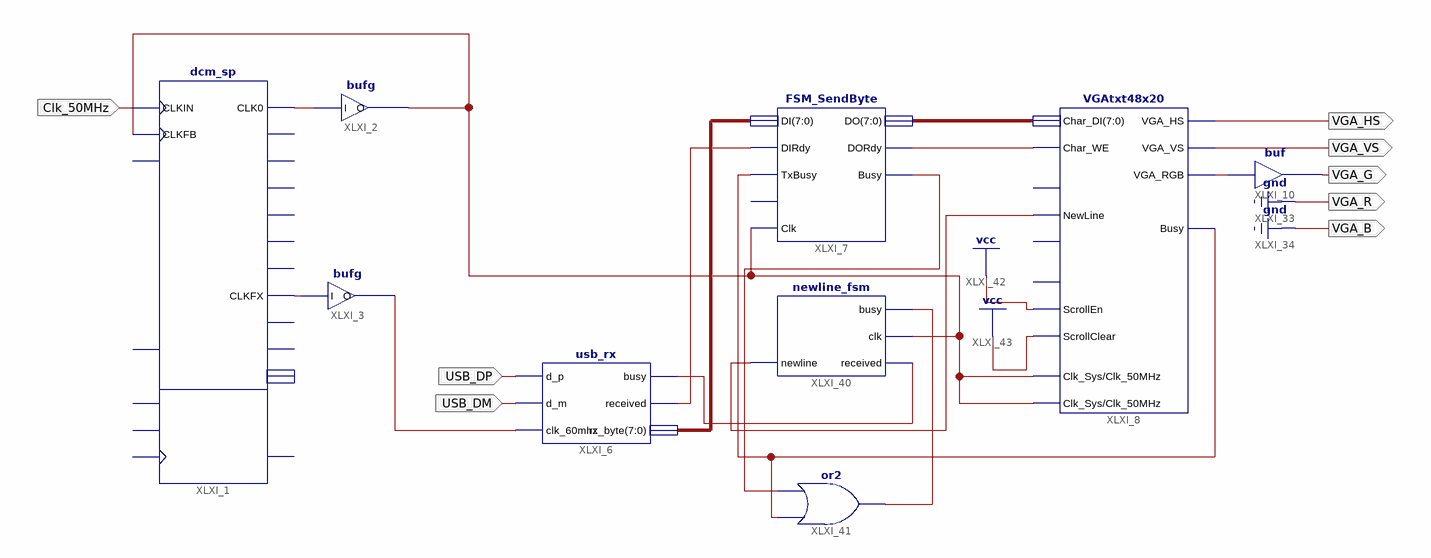
[diagram p0: schematic sheet 1]
// Xilinx ISE schematic top_lvl.sch (spartan3e) as structural Verilog: 9 symbols, 8 ports
module top_lvl (
  input  Clk_50MHz,
  input  USB_DM,
  input  USB_DP,
  output VGA_HS,
  output VGA_VS,
  output VGA_R,
  output VGA_G,
  output VGA_B
);

  wire Clk_50, Clk_Sys, XLXN_2, XLXN_3, XLXN_7, XLXN_77, XLXN_82, XLXN_93, XLXN_98, XLXN_99, XLXN_100,
       XLXN_101;
  wire [7:0] XLXN_75, XLXN_76;

  FSM_SendByte XLXI_7 (
    .Clk(Clk_50), .DIRdy(XLXN_82), .TxBusy(XLXN_101), .DI(XLXN_75), .DORdy(XLXN_77), .Busy(XLXN_100),
    .DO(XLXN_76));  // open: Reset
  usb_rx XLXI_6 (
    .d_p(USB_DP), .d_m(USB_DM), .clk_60mhz(Clk_Sys), .busy(XLXN_98), .received(XLXN_82), .rx_byte(XLXN_75));
  bufg XLXI_3 (.I(XLXN_3), .O(Clk_Sys));
  bufg XLXI_2 (.I(XLXN_2), .O(Clk_50));
  dcm_sp #(.CLKFX_MULTIPLY(6), .CLKFX_DIVIDE(5)) XLXI_1 (
    .CLKFB(Clk_50), .CLKIN(Clk_50MHz), .CLK0(XLXN_2), .CLKFX(XLXN_3));  // open: DSSEN, PSCLK, PSEN, PSINCDEC, RST, CLK180, CLK270, CLK2X, CLK2X180, CLK90, CLKDV, CLKFX180, LOCKED, PSDONE, STATUS
  VGAtxt48x20 XLXI_8 (
    .Char_DI(XLXN_76), .NewLine(XLXN_93), .Clk_Sys(Clk_50), .Clk_50MHz(Clk_50), .ScrollEn(1'b1),
    .ScrollClear(1'b1), .Busy(XLXN_101), .VGA_HS(VGA_HS), .VGA_VS(VGA_VS), .VGA_RGB(XLXN_7), .Char_WE(XLXN_77));  // open: Home, Goto00, CursorOn
  buf XLXI_10 (VGA_G, XLXN_7);
  newline_fsm XLXI_40 (.received(XLXN_98), .clk(Clk_50), .busy(XLXN_99), .newline(XLXN_93));
  or XLXI_41 (XLXN_99, XLXN_101, XLXN_100);

  assign VGA_B = 1'b0;
  assign VGA_R = 1'b0;
endmodule
